# Altium schematic sheet 05)NorFlash,NandFlash.SchDoc
size 297 x 209 mm
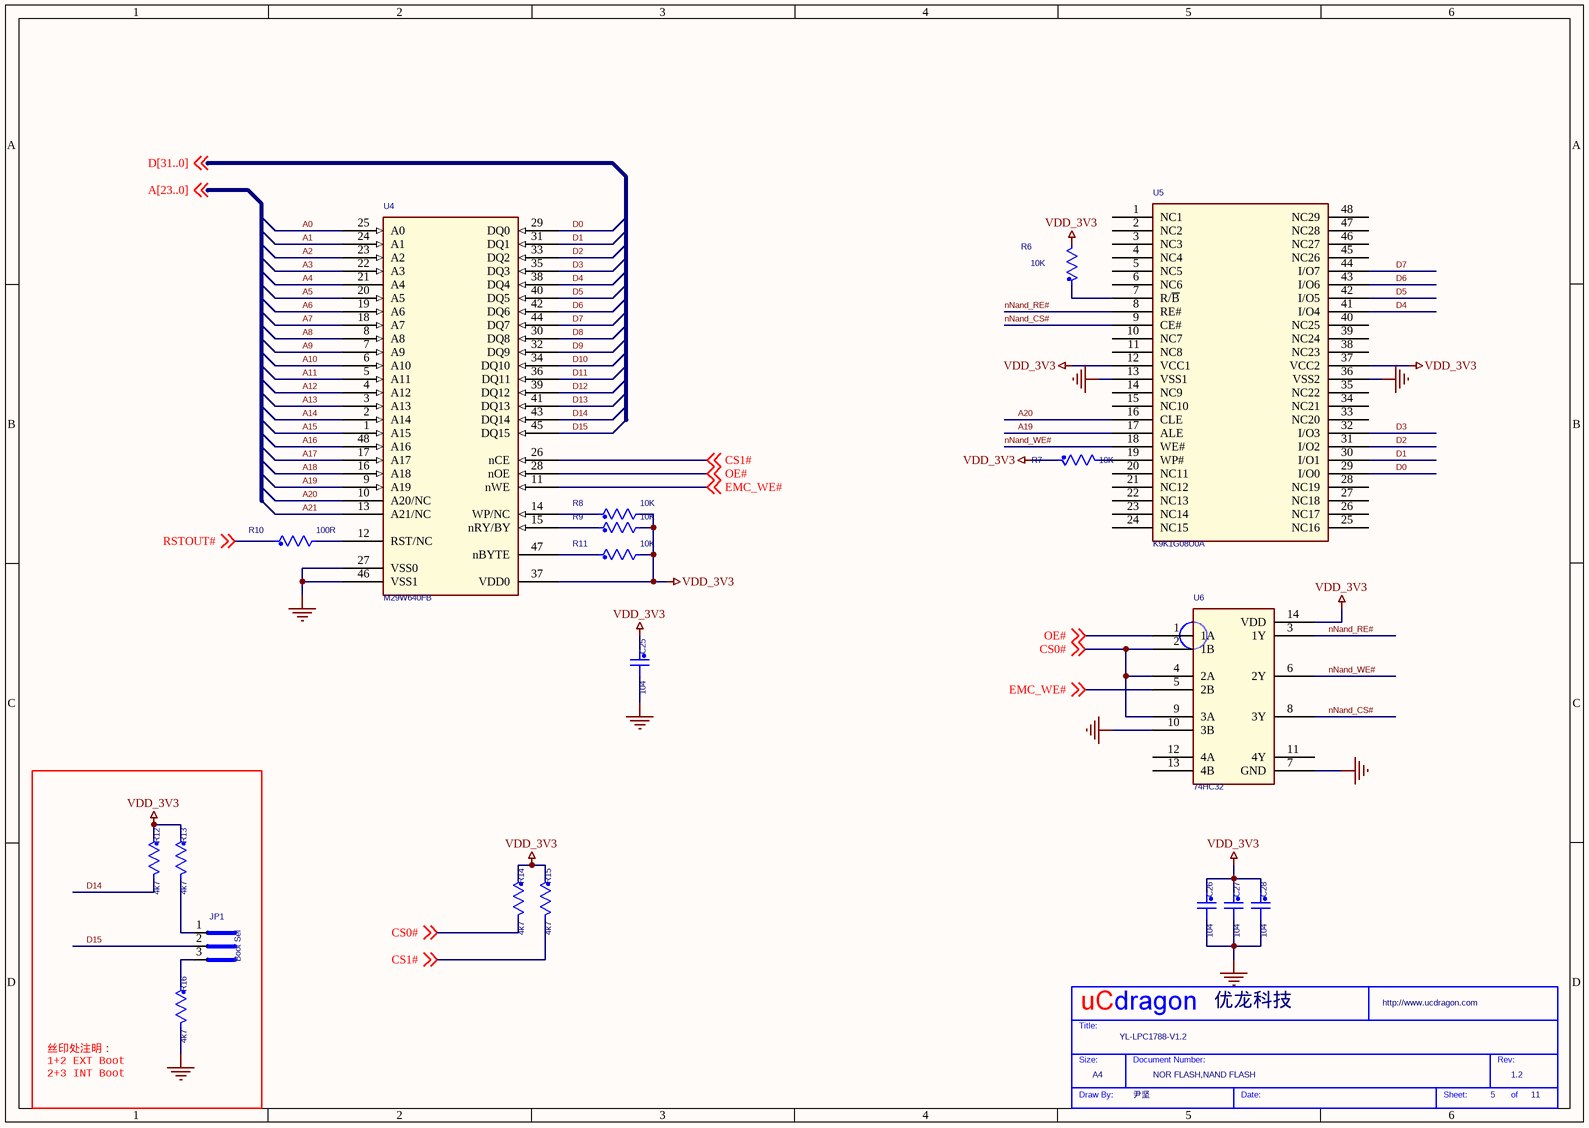
[diagram p0: 05)NorFlash,NandFlash.SchDoc]

## Parts
*  Page Count: 11  Page Number: 5  Page Size: A4  Title: YL-LPC1788-V1.2  RevCode: 1.2  Doc: NOR FLASH,NAND FLASH  Drawing: 尹坚  Company: 优龙科技  (hidden comment: My Title 0)  (graphical)
C25  104  [CAP0805]
C26  104  [CAP0805]
C27  104  [CAP0805]
C28  104  [CAP0805]
JP1  Boot Sel
R6  10K
R7  10K
R8  10K
R9  10K
R10  100R
R11  10K
R12  4k7
R13  4k7
R14  4k7
R15  4k7
R16  4k7
U4  M29W640FB  [SST39VF1601-TSOP48A]
U5  K9K1G08U0A  [TSOP1]
U6  74HC32

## Nets
GND_POWER: C25.2 C26.2 C27.2 C28.2 R16.2 U4.27(VSS0) U4.46(VSS1) U5.13(VSS1) U5.36(VSS2) U6.7(GND) U6.10(3B)
VDD_3V3: C25.1 C26.1 C27.1 C28.1 R6.2 R7.1 R8.2 R9.2 R11.2 R12.1 R13.1 R14.1 R15.1 U4.37(VDD0) U5.12(VCC1) U5.37(VCC2) U6.14(VDD)
A0: U4.25(A0)
A1: U4.24(A1)
A2: U4.23(A2)
A3: U4.22(A3)
A4: U4.21(A4)
A5: U4.20(A5)
A6: U4.19(A6)
A7: U4.18(A7)
A8: U4.8(A8)
A9: U4.7(A9)
A10: U4.6(A10)
A11: U4.5(A11)
A12: U4.4(A12)
A13: U4.3(A13)
A14: U4.2(A14)
A15: U4.1(A15)
A16: U4.48(A16)
A17: U4.17(A17)
A18: U4.16(A18)
A19: U4.9(A19) U5.17(ALE)
A20: U4.10(A20/NC) U5.16(CLE)
A21: U4.13(A21/NC)
CS0#: R14.2 U6.2(1B) U6.4(2A) U6.9(3A) ; off-sheet CS0#
CS1#: R15.2 U4.26(nCE) ; off-sheet CS1#
D0: U4.29(DQ0) U5.29(I/O0)
D1: U4.31(DQ1) U5.30(I/O1)
D2: U4.33(DQ2) U5.31(I/O2)
D3: U4.35(DQ3) U5.32(I/O3)
D4: U4.38(DQ4) U5.41(I/O4)
D5: U4.40(DQ5) U5.42(I/O5)
D6: U4.42(DQ6) U5.43(I/O6)
D7: U4.44(DQ7) U5.44(I/O7)
D8: U4.30(DQ8)
D9: U4.32(DQ9)
D10: U4.34(DQ10)
D11: U4.36(DQ11)
D12: U4.39(DQ12)
D13: U4.41(DQ13)
D14: R12.2 U4.43(DQ14)
D15: JP1.2 U4.45(DQ15)
EMC_WE#: U4.11(nWE) U6.5(2B) ; off-sheet EMC_WE#
nNand_CS#: U5.9(CE#) U6.8(3Y)
nNand_RE#: U5.8(RE#) U6.3(1Y)
nNand_WE#: U5.18(WE#) U6.6(2Y)
OE#: U4.28(nOE) U6.1(1A) ; off-sheet OE#
RSTOUT#: R10.1 ; off-sheet RSTOUT#
NetJP1_1: JP1.1 R13.2
NetJP1_3: JP1.3 R16.1
NetR6_1: R6.1 U5.7(R/~{B})
NetR7_2: R7.2 U5.19(WP#)
NetR8_1: R8.1 U4.14(WP/NC)
NetR9_1: R9.1 U4.15(nRY/BY)
NetR10_2: R10.2 U4.12(RST/NC)
NetR11_1: R11.1 U4.47(nBYTE)

Not connected (* = marked no-connect by the designer): U5 1(NC1) 2(NC2) 3(NC3) 4(NC4) 5(NC5) 6(NC6) 10(NC7) 11(NC8) 14(NC9) 15(NC10) 20(NC11) 21(NC12) 22(NC13) 23(NC14) 24(NC15) 25(NC16) 26(NC17) 27(NC18) 28(NC19) 33(NC20) 34(NC21) 35(NC22) 38(NC23) 39(NC24) 40(NC25) 45(NC26) 46(NC27) 47(NC28) 48(NC29); U6 11(4Y) 12(4A) 13(4B)

## Notes on the sheet
- (near R16) 丝印处注明：
  1+2 EXT Boot
  2+3 INT Boot
- (in symbol My Title 0) Title:; Size:; Document Number:; Rev:; Draw By:; Date:; Sheet:; of

## Library data of the parts
C25-C28 = C_Generic_Dup2
JP1 = 3PIN
R6-R16 = R_Generic_Dup1
U4 = SST29LV800_1: P/N #1: TSOP48
* = My Title 0: Page Create Date: May 29, 2006; WebSite: http://www.ucdragon.com